# EasyEDA schematic SCH_Do_an1_2023-05-08.json
TITLE: Sheet_1; REV: 1.0; Date: 2023-03-12; Sheet: 1/1; Company: Your Company
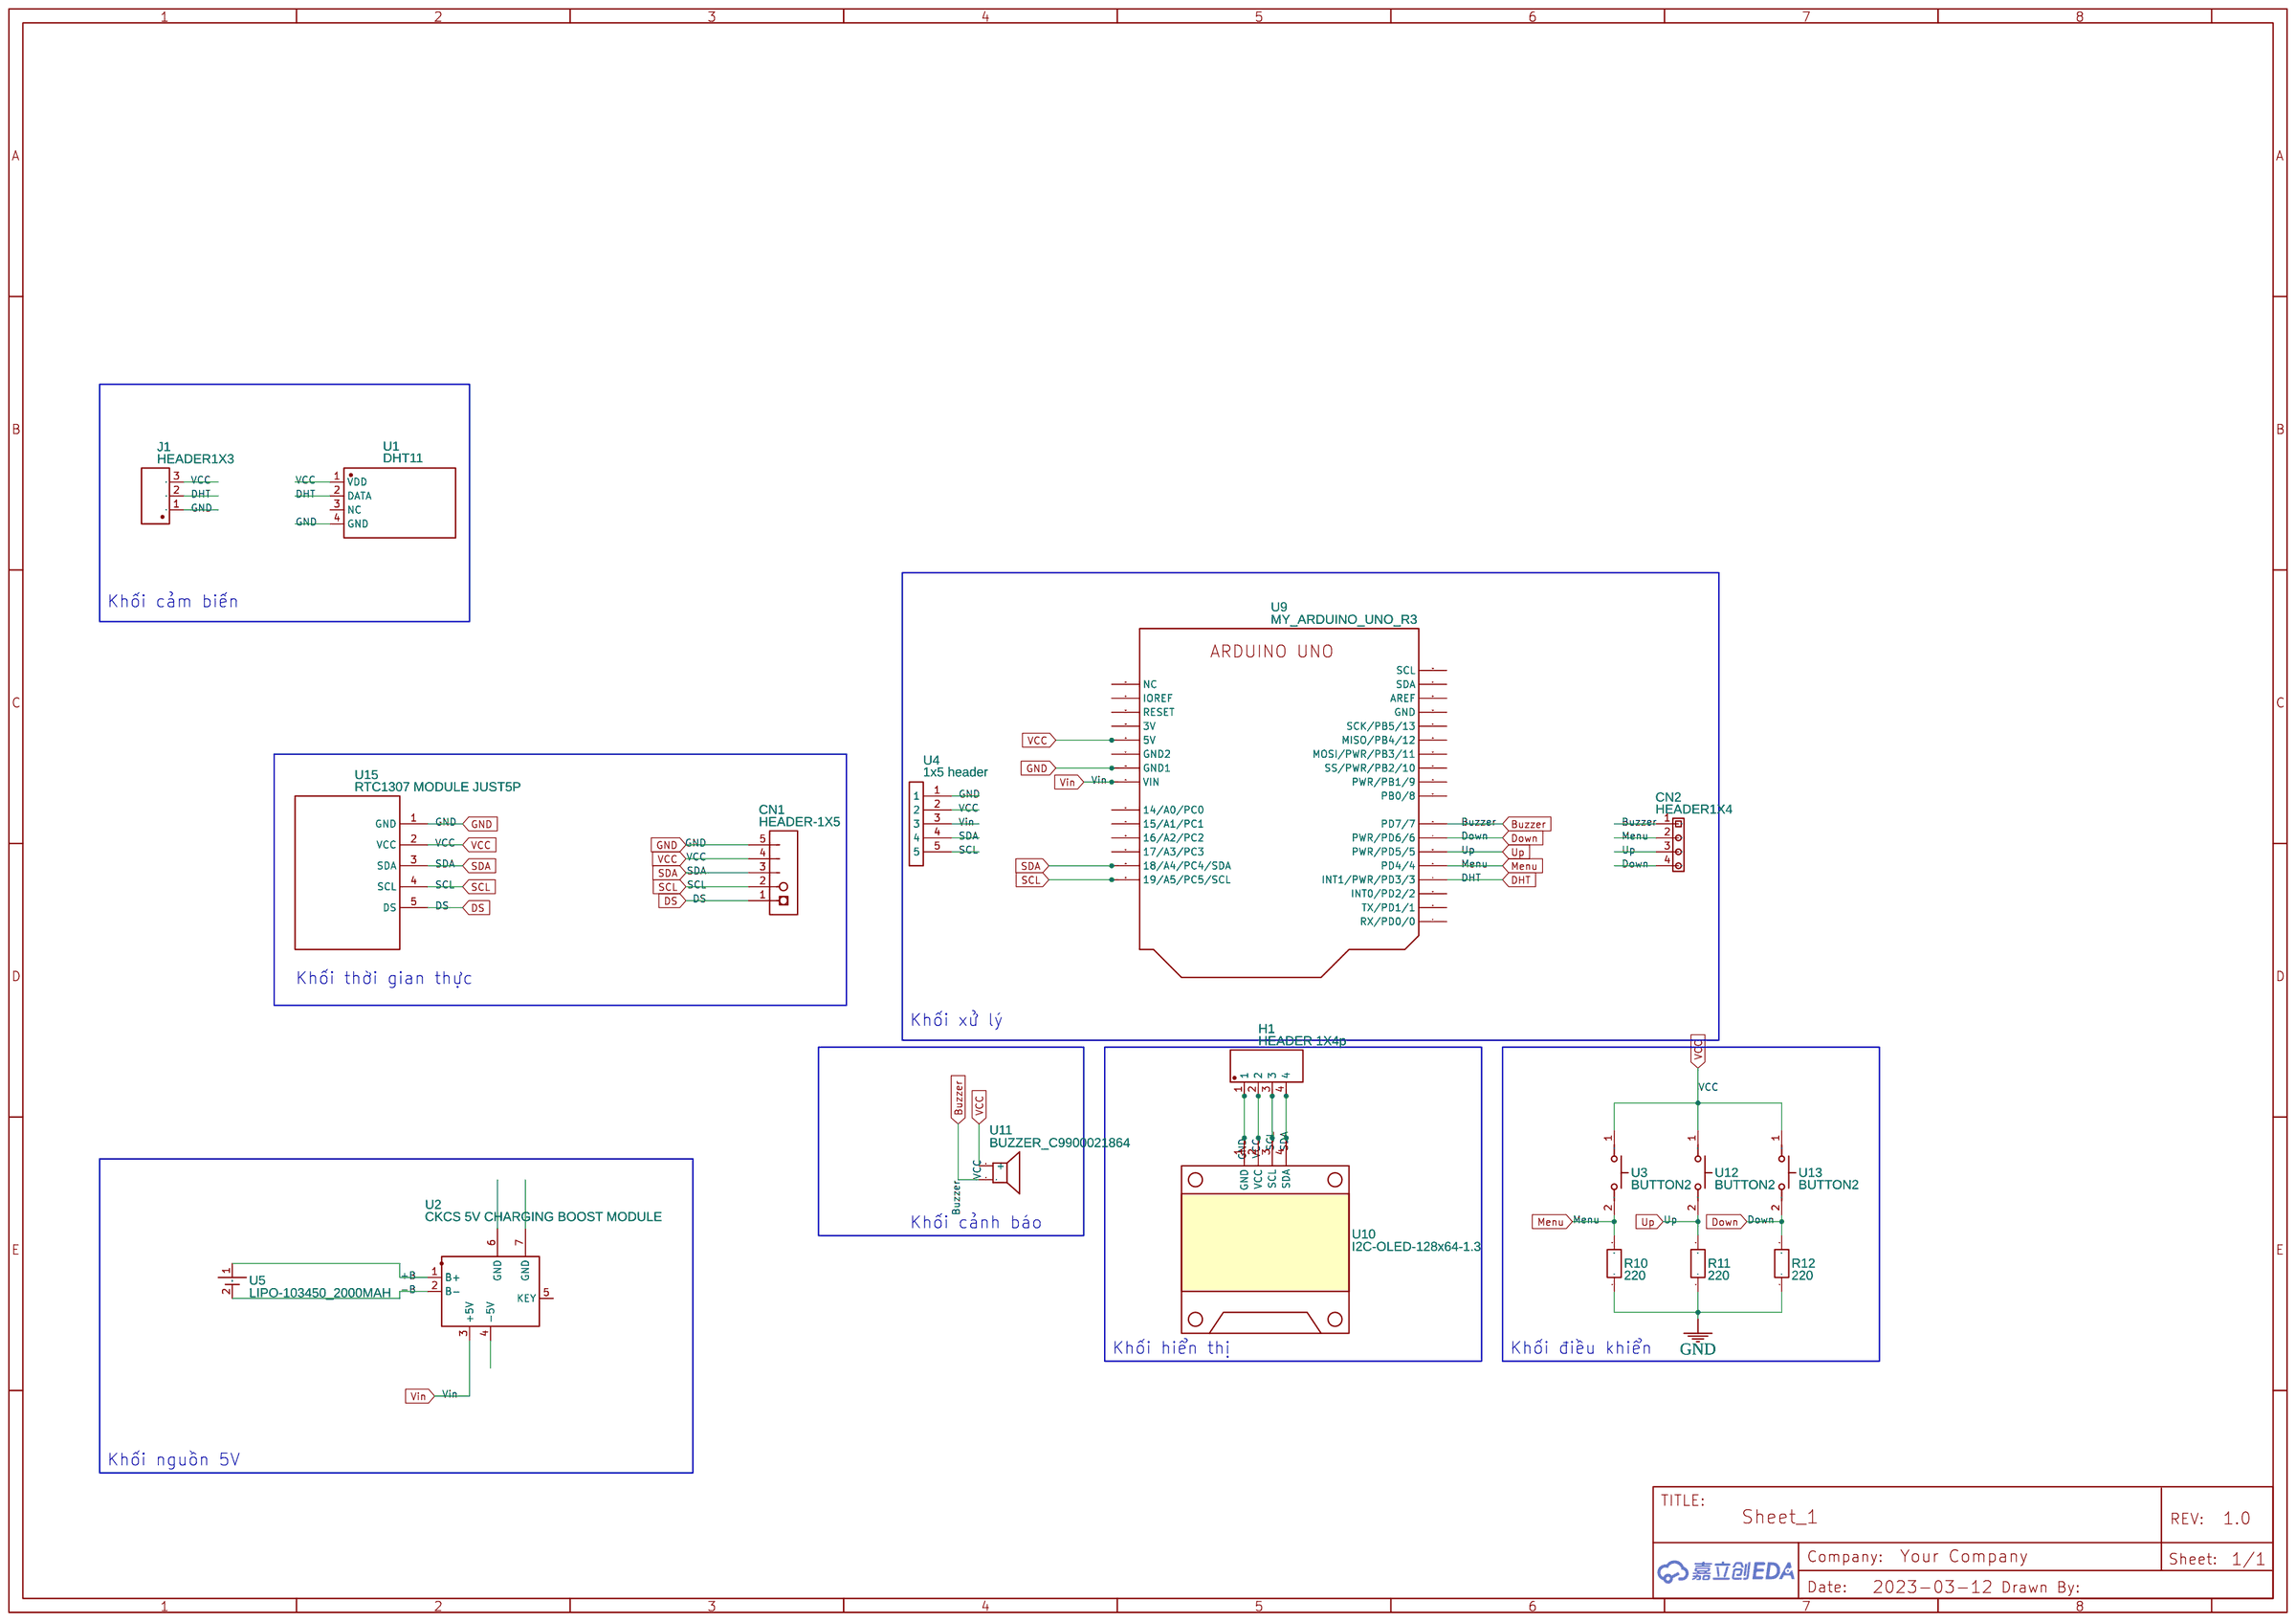
[diagram p0: schematic sheet]

## Parts
CN1  HEADER-1X5  [HEADER-1X5]
CN2  HEADER1X4  [HEADER1X4]
H1  HEADER 1X4p  [HEADER - HEADER-FEMALE-2.54_1X4]
J1  HEADER1X3  [HEADER1X3]
R10  220  [R0603]
R11  220  [R0603]
R12  220  [R0603]
U1  DHT11  [SENSOR-TH_DHT11]
U2  CKCS 5V CHARGING BOOST MODULE  [CKCS 5V CHARGING MODULE]
U3  BUTTON2  [SW-SMD_L6.0-W3.5-LS8.0-1]
U4  1x5 header  [1X5 HEADER]
U5  LIPO-103450_2000MAH  [LIPO-103450_2000MAH]
U9  MY_ARDUINO_UNO_R3  [UNO_R3;WO ARDUINO UNO]
U10  I2C-OLED-128x64-1.3  [I2C-OLED-128X64-1.3]
U11  BUZZER_C9900021864  [BUZ-SMD_BUZZER]
U12  BUTTON2  [SW-SMD_L6.0-W3.5-LS8.0-1]
U13  BUTTON2  [SW-SMD_L6.0-W3.5-LS8.0-1]
U15  RTC1307 MODULE JUST5P  [RTC1307 MODULE]

## Library data of the parts
CN1 = HEADER-1X5: Supplier 1: Digi-Key; Supplier Part Number 1: S1011E-36-ND; REEL: TH; Contributor: salmanlanjekar
CN2 = HEADER1X4: Contributor: easyeda-sp
H1 = HEADER 1X4p: Contributor: trananhkha2406; Supplier: Sparkfun
J1 = HEADER1X3: Contributor: Nathan Milligan
R10-R12 = R_0603_EU: Contributor: LCEDA_Lib
U1 = DHT11: Supplier: LCSC; Supplier Part: C117051; Manufacturer: 广州奥松; Contributor: LCSC; JLCPCB Part Class: Extended Part
U2 = CKCS 5V CHARGING BOOST MODULE: Supplier: DYKBmetered; link: https://www.aliexpress.com/item/1005001428397158.html?spm=a2g0s.9042311.0.0.17b44c4d9Ls686; Contributor: odorica
U3 U12 U13 = BUTTON2: Supplier: LCSC; Supplier Part: C9900005988; Manufacturer: null; JLCPCB Part Class: Extended Part; Contributor: LCSC
U4 = 1x5 header: Contributor: tomme10
U5 = LIPO-103450_2000MAH: link: https://www.myarduino.net/product/2675/%E0%B9%81%E0%B8%9A%E0%B8%95%E0%B9%80%E0%B8%95%E0%B8%AD%E0%B8%A3%E0%B8%B5%E0%B9%88-%E0%B8%A5%E0%B8%B5%E0%B9%80%E0%B8%98%E0%B8%B5%E0%B9%88%E0%B8%A2%E0%B8%A1%E0%B9%82%E0%B8%9E%E0%B8%A5%E0%B8%B4%E0%B9%80%E0%B8%A1%E0%B8%AD%E0%B8%A3%E0%B9%8C-3-7v-%E0%B8%84%E0%B8%A7%E0%B8%B2%E0%B8%A1%E0%B8%88%E0%B8%B8-2000mah-103450-lithium-polymer-battery; Contributor: MEBenz
U9 = MY_ARDUINO_UNO_R3: Contributor: kiliki9334
U10 = I2C-OLED-128x64-1.3: Contributor: john089
U11 = BUZZER_C9900021864: Supplier: LCSC; Supplier Part: C9900021864; Manufacturer: null; Manufacturer Part: BUZZER; JLCPCB Part Class: Extended Part; Contributor: lcsc
U15 = RTC1307 MODULE JUST5P: link: https://www.openhacks.com/uploadsproductos/tiny_rtc_-_elecrow.pdf; Contributor: Abdul Muis

## Nets
GND: CN1.5 H1.1 J1.1 R10.1 R11.1 R12.1 U1.4(GND) U4.1 U9.26(GND1) U10.1(GND) U15.1(GND)
VCC: CN1.4 H1.2 J1.3 U1.1(VDD) U3.1 U4.2 U9.28(5V) U10.2(VCC) U11.2(+) U12.1 U13.1 U15.2(VCC)
Vin: U2.3(+5V) U4.3 U9.25(VIN)
+B: U2.1(B+) U5.1(POS)
-B: U2.2(B-) U5.2(POS)
Buzzer: CN2.1 U9.8(PD7/7) U11.1
DHT: J1.2 U1.2(DATA) U9.4(INT1/PWR/PD3/3)
Down: CN2.4 R12.2 U9.7(PWR/PD6/6) U13.2
DS: CN1.1 U15.5(DS)
Menu: CN2.2 R10.2 U3.2 U9.5(PD4/4)
SCL: CN1.2 H1.3 U4.5 U9.19(19/A5/PC5/SCL) U10.3(SCL) U15.4(SCL)
SDA: CN1.3 H1.4 U4.4 U9.20(18/A4/PC4/SDA) U10.4(SDA) U15.3(SDA)
Up: CN2.3 R11.2 U9.6(PWR/PD5/5) U12.2

Not connected (* = marked no-connect by the designer): U1 3(NC); U2 4(-5V) 5(KEY) 6(GND) 7(GND); U9 1(RX/PD0/0) 2(TX/PD1/1) 3(INT0/PD2/2) 9(PB0/8) 10(PWR/PB1/9) 11(SS/PWR/PB2/10) 12(MOSI/PWR/PB3/11) 13(MISO/PB4/12) 14(SCK/PB5/13) 15(GND) 16(AREF) 17(SDA) 18(SCL) 21(17/A3/PC3) 22(16/A2/PC2) 23(15/A1/PC1) 24(14/A0/PC0) 27(GND2) 29(3V) 30(RESET) 31(IOREF) 32(NC)

## Notes on the sheet
- Khối cảm biến
- Khối thời gian thực
- Khối xử lý
- Khối cảnh báo
- Khối hiển thị
- Khối điều khiển
- Khối nguồn 5V
